# EAGLE design pneu-sensor (EAGLE 9.1.2)
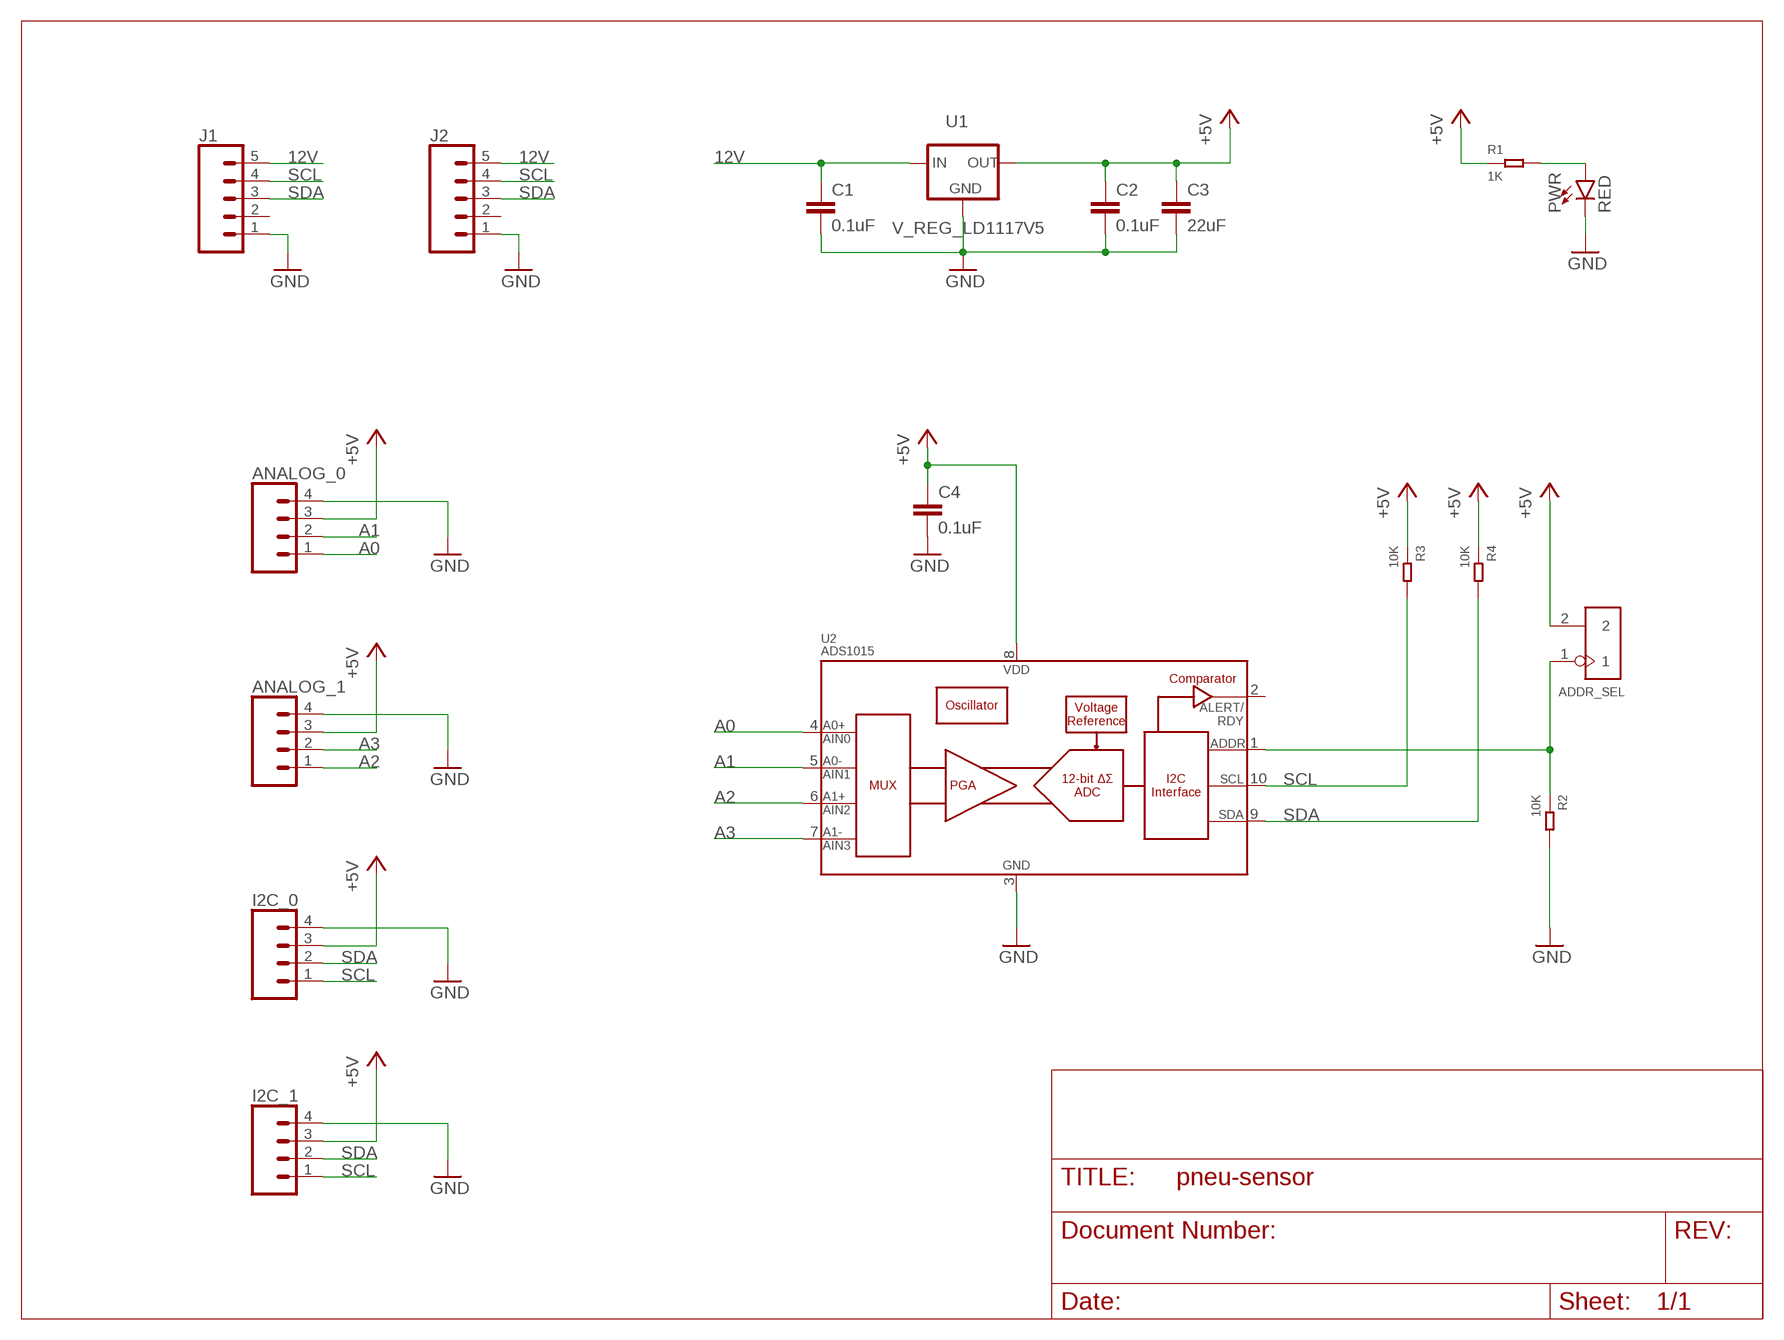
[diagram p0: schematic, sheet 1]

## Parts
ADDR_SEL  DIP-BLACK-JUMPER  [H2-2.54]
ANALOG_0  CONN_04JST-PTH-VERT  [JST-4-PTH-VERT]
ANALOG_1  CONN_04JST-PTH-VERT  [JST-4-PTH-VERT]
C1  0.1uF  0.1UF-0603-25V-(+80/-20%)  [0603]
C2  0.1uF  0.1UF-0603-25V-(+80/-20%)  [0603]
C3  22uF  10UF-1206-6.3V-20%  [1206]
C4  0.1uF  0.1UF-0603-25V-(+80/-20%)  [0603]
I2C_0  CONN_04JST-PTH-VERT  [JST-4-PTH-VERT]
I2C_1  CONN_04JST-PTH-VERT  [JST-4-PTH-VERT]
J1  CONN_05  [1X05]
J2  CONN_05  [1X05]
PWR  RED  LED-RED0603  [LED-0603]
R1  1K  SMD-RES-1K-5%-1/8W(0805)  [R0805]
R2  10K  SMD-RES-10K-1%-1/8W(0805)  [R0805]
R3  10K  SMD-RES-10K-1%-1/8W(0805)  [R0805]
R4  10K  SMD-RES-10K-1%-1/8W(0805)  [R0805]
U1  V_REG_LD1117V5  V_REG_LD1117VXXLD1117-SMD  [SOT223]
U2  ADS1015  [MSOP10]

## Nets
12V: C1.1 J1.5 J2.5 U1.3(IN)
+5V: ADDR_SEL.2 ANALOG_0.3 ANALOG_1.3 C2.1 C3.1 C4.1 I2C_0.3 I2C_1.3 R1.1 R3.1 R4.1 U1.2(OUT) U1.4(OUT) U2.8(VDD)
A0: ANALOG_0.1 U2.4(AIN0)
A1: ANALOG_0.2 U2.5(AIN1)
A2: ANALOG_1.1 U2.6(AIN2)
A3: ANALOG_1.2 U2.7(AIN3)
GND: ANALOG_0.4 ANALOG_1.4 C1.2 C2.2 C3.2 C4.2 I2C_0.4 I2C_1.4 J1.1 J2.1 PWR.C R2.2 U1.1(GND) U2.3(VSS)
N$2: ADDR_SEL.1 R2.1 U2.1(ADDR)
N$3: PWR.A R1.2
SCL: I2C_0.1 I2C_1.1 J1.4 J2.4 R3.2 U2.10(SCL)
SDA: I2C_0.2 I2C_1.2 J1.3 J2.3 R4.2 U2.9(SDA)
Unconnected: J1.2 J2.2 U2.2(ALERT/RDY)

## Library data of the parts
ADDR_SEL = Seeed-Connector:DIP-BLACK-JUMPER: 320190003
ANALOG_0 ANALOG_1 I2C_0 I2C_1 = SparkFun-Connectors:CONN_04: Multi connection point. Often used as Generic Header-pin footprint for 0.1 inch spaced/style header connections On any of the 0.1 inch spaced packages, you can populate with these: Break Away Headers - Straight <https://www.sparkfun.com/products/116> (PRT-00116) Break Away Male Headers - Right Angle <https://www.sparkfun.com/products/553> (PRT-00553) Female Headers <https://www.sparkfun.com/products/115> (PRT-00115) Break Away Headers - Machine Pin <https://www.sparkfun.com/products/117> (PRT-00117) Break Away Female Headers - Swiss Machine Pin <https://www.sparkfun.com/products/743> (PRT-00743) For SCREWTERMINALS and SPRING TERMINALS visit here: Screw Terimnals on SparkFun.com <https://www.sparkfun.com/search/results?term=Screw+Terminals> (5mm/3.5mm/2.54mm spacing) This device is also useful as a general connection point to wire up your design to another part of your project. Our various solder wires solder well into these plated through hole pads. Hook-Up Wire - Assortment (Stranded, 22 AWG) <https://www.sparkfun.com/products/11375> (PRT-11375) Hook-Up Wire - Assortment (Solid Core, 22 AWG) <https://www.sparkfun.com/products/11367> (PRT-11367) View the entire wire category on our website here <https://www.sparkfun.com/categories/141> Special notes: Molex polarized connector foot print use with SKU : PRT-08231 with associated crimp pins and housings. 1MM SMD Version SKU: PRT-10208; PROD_ID: CONN-13251
C1 C2 C4 = SparkFun-Capacitors:0.1UF: 0.1µF ceramic capacitors A capacitor is a passive two-terminal electrical component used to store electrical energy temporarily in an electric field.; PROD_ID: CAP-00810
C3 = SparkFun-Capacitors:10UF: 10.0µF ceramic capacitors A capacitor is a passive two-terminal electrical component used to store electrical energy temporarily in an electric field.; PROD_ID: CAP-10057; VALUE: 10uF
J1 J2 = SparkFun-Connectors:CONN_05: Multi connection point. Often used as Generic Header-pin footprint for 0.1 inch spaced/style header connections On any of the 0.1 inch spaced packages, you can populate with these: Break Away Headers - Straight <https://www.sparkfun.com/products/116> (PRT-00116) Break Away Male Headers - Right Angle <https://www.sparkfun.com/products/553> (PRT-00553) Female Headers <https://www.sparkfun.com/products/115> (PRT-00115) Break Away Headers - Machine Pin <https://www.sparkfun.com/products/117> (PRT-00117) Break Away Female Headers - Swiss Machine Pin <https://www.sparkfun.com/products/743> (PRT-00743) For SCREWTERMINALS and SPRING TERMINALS visit here: Screw Terimnals on SparkFun.com <https://www.sparkfun.com/search/results?term=Screw+Terminals> (5mm/3.5mm/2.54mm spacing) This device is also useful as a general connection point to wire up your design to another part of your project. Our various solder wires solder well into these plated through hole pads. Hook-Up Wire - Assortment (Stranded, 22 AWG) <https://www.sparkfun.com/products/11375> (PRT-11375) Hook-Up Wire - Assortment (Solid Core, 22 AWG) <https://www.sparkfun.com/products/11367> (PRT-11367) View the entire wire category on our website here <https://www.sparkfun.com/categories/141> Special notes: Molex polarized connector foot print use with SKU : PRT-08231 with associated crimp pins and housings. 1MM SMD Version SKU: PRT-10208
PWR = SparkFun-LED:LED-RED: Red SMD LED Used in manufacturing of most products at SparkFun Packages: 0603 - SMD 0603 package [Product Link] <http://docs.avagotech.com/docs/AV02-0551EN> 0603 SMART - SMD 0603 SMART package ( more efficient and expensive)[Product Link] <http://www.osram-os.com/Graphics/XPic2/00077099_0.pdf> 1206 - SMD1206 package [Product Link] <https://www.sparkfun.com/datasheets/DevTools/LilyPad/Q150OVS4.pdff> SparkFun Products: Pro Mini 328 -5V <https://www.sparkfun.com/products/821> RedBoard <https://www.sparkfun.com/products/12757> IOIO-OTG <https://www.sparkfun.com/products/13613>; PROD_ID: DIO-00819
R1 = Seeed-Resistor:SMD-RES-1K-5%-1/8W(0805): 301010311; MPN: RC0805JR-071KL
R2-R4 = Seeed-Resistor:SMD-RES-10K-1%-1/8W(0805): 301010361; MPN: RC0805FR-0710KL
U1 = SparkFun-IC-Power:V_REG_LD1117VXX: LD1117VXX voltage regulator. We carry the 3.3V version (COM-00526) in TO-220 package.; PROD_ID: VREG-13917
U2 = SparkFun-IC-Conversion:ADS1015: ADS1015 12-BIT ADC 12-Bit Del-Sig ADC Four single-ended inputs or two differential inputs Internal PGA I2C interface 2.0-5.5V SparkFun Products SparkFun Block for Intel Edison - ADC <https://www.sparkfun.com/products/13770> (DEV-13770); PROD_ID: IC-12270

## Board
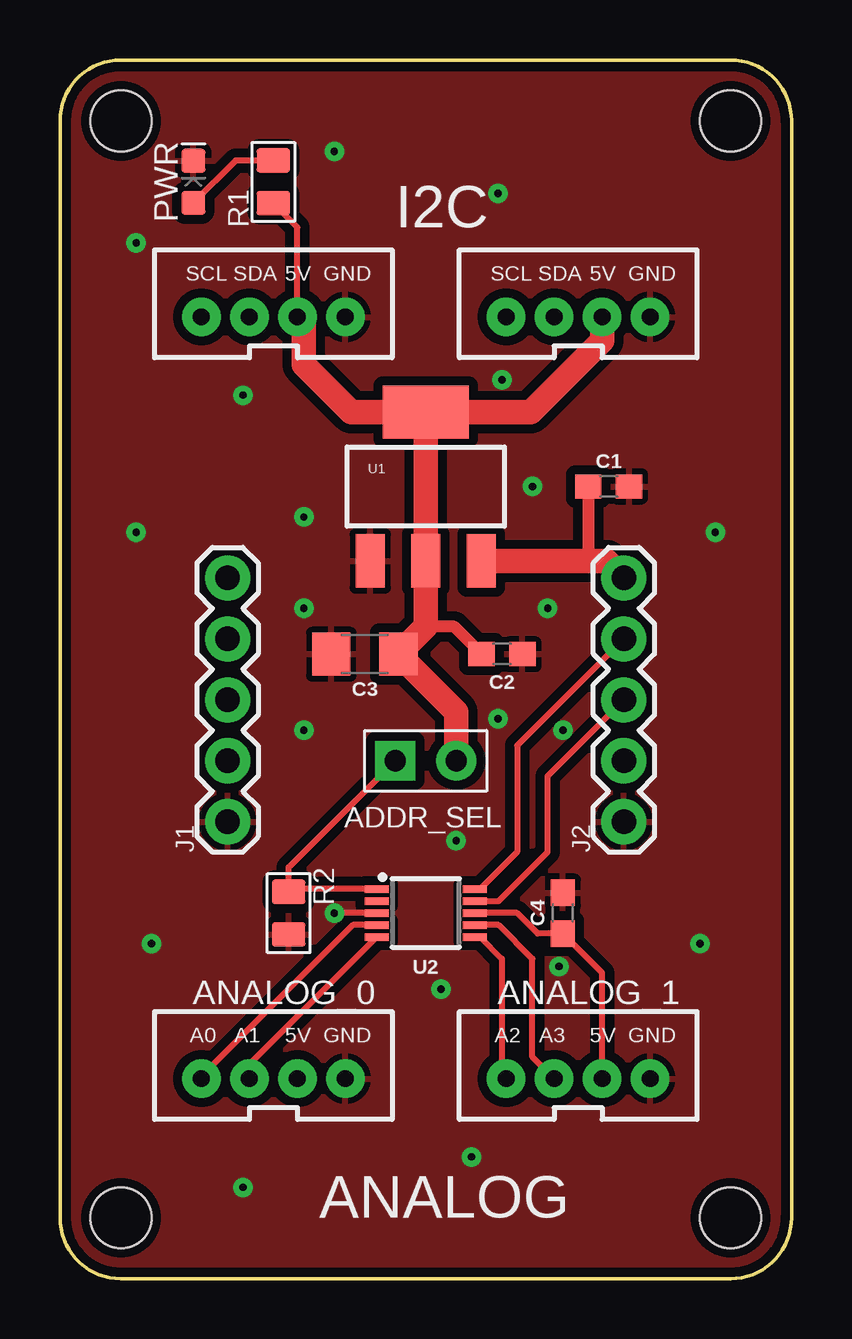
[diagram p1: board, top side]
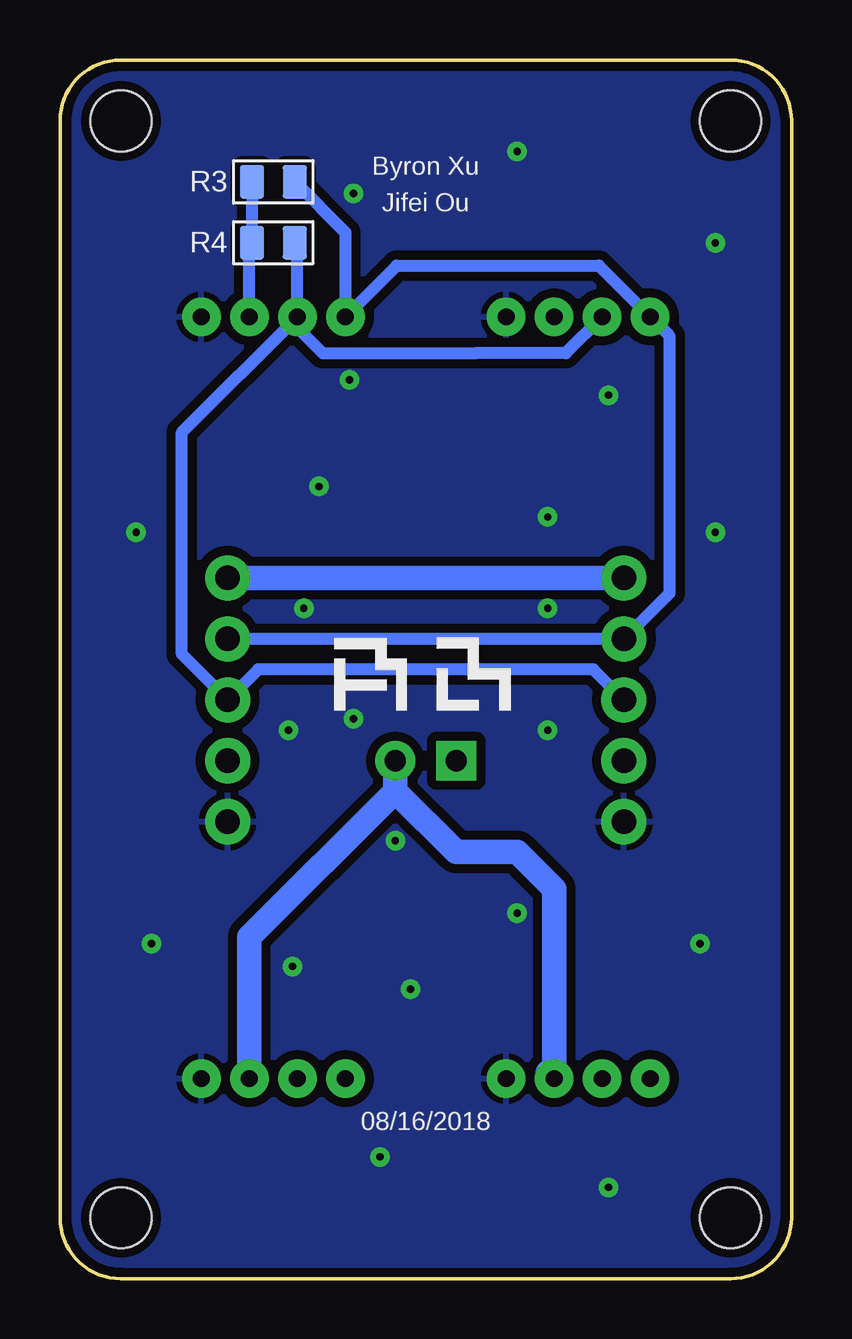
[diagram p2: board, bottom side, seen from below]

Size 30.48 x 50.8 mm. Coordinates in mm from the lower left corner, seen from the top.
Outline: 2.54,0 arc-90 0,2.54 0,48.26 arc-90 2.54,50.8 27.94,50.8 arc-90 30.48,48.26 30.48,2.54 arc-90 27.94,0 2.54,0
Copper layers (1*16): Top 0.035mm / dielectric 1.5mm / Bottom 0.035mm
Design rules "SparkFun": minimum track width 8mil, minimum drill 20mil, track to track 8mil, track to pad 8mil, pad to pad 8mil, via to via 8mil, smd to smd 8mil, copper to edge 8mil, drill to drill 8mil, minimum pad ring 12mil, minimum via ring 10mil, stop-mask expansion 4mil, vias tented up to drill 20mil, thermal gap 10mil
Holes 2.54 mm at 2.54,48.26 27.94,48.26 27.94,2.54 2.54,2.54

### Footprints (pad centres in the part's own frame; a part is rotated, then mirrored left to right if it is on the bottom)
H2-2.54 = drill 0.889 pad 1.651 square: 1 0,1.27 | drill 0.889 pad 1.651: 2 0,-1.27
JST-4-PTH-VERT = drill 0.7 pad 1.6: 1 -3,-0.55; 2 -1,-0.55; 3 1,-0.55; 4 3,-0.55
0603 = smd 1.1 x 1: 1 -0.85,0; 2 0.85,0
1206 = smd 1.6 x 1.8: 1 -1.4,0; 2 1.4,0
1X05 = drill 1.016 pad 1.88: 1 0,0; 2 2.54,0; 3 5.08,0; 4 7.62,0; 5 10.16,0
LED-0603 = smd 1 x 1: A -0.877,0; C 0.877,0
R0805 = smd 1.397 x 1.016: 1 0,0.889; 2 0,-0.889
SOT223 = smd 1.219 x 2.235: 1 -2.311,-3.099; 2 0,-3.099; 3 2.311,-3.099 | smd 3.6 x 2.2: 4 0,3.099
MSOP10 = smd 0.3 x 1: 1 -1,-2.05; 2 -0.5,-2.05; 3 0,-2.05; 4 0.5,-2.05; 5 1,-2.05; 6 1,2.05; 7 0.5,2.05; 8 0,2.05; 9 -0.5,2.05; 10 -1,2.05

### Placement (x,y rotation side)
ADDR_SEL  15.24,21.59 90 top
ANALOG_0  8.89,8.89 0 top
ANALOG_1  21.59,8.89 0 top
C1  22.86,33.02 0 top
C2  18.41,26.04 0 top
C3  12.7,26.04 180 top
C4  20.95,15.24 90 top
I2C_0  8.89,40.64 0 top
I2C_1  21.59,40.64 0 top
J1  6.99,19.05 90 top
J2  23.49,19.05 90 top
PWR  5.56,45.72 90 top
R1  8.89,45.72 180 top
R2  9.53,15.24 0 top
R3  21.59,45.72 90 bottom
R4  21.59,43.18 90 bottom
U1  15.24,33.02 0 top
U2  15.24,15.24 270 top

### Tracks (layer width: path | path; a pad name or v marks a point on that pad's centre or on a via)
12V
  Top 0.508: C1.1 22.01,30.34 21.59,29.92
  Top 1.016: J2.5 22.78,29.92 21.59,29.92 U1.3
  Bottom 1.016: J1.5 J2.5
+5V
  Top 0.254: U2.8 19.05,15.24 19.9,14.39 C4.1 22.59,12.76 ANALOG_1.3 | I2C_0.3 9.89,43.83 R1.1
  Top 0.508: C2.1 16.43,27.18 15.24,27.18
  Top 1.016: U1.4 U1.2 15.24,27.18 C3.1 16.51,23.62 ADDR_SEL.2 | I2C_1.3 22.59,39.1 19.61,36.12 U1.4 | I2C_0.3 10.16,39.82 10.16,38.1 12.14,36.12 U1.4
  Bottom 0.508: I2C_1.3 22.59,43.07 R4.1 22.48,44.83 R3.1
  Bottom 1.016: ADDR_SEL.2 16.51,20.32 | 10.16,8.61 ANALOG_0.3 9.89,16.24 11.43,17.78 13.97,17.78 16.51,20.32 | 16.51,20.32 22.59,14.24 ANALOG_1.3
A0
  Top 0.254: U2.4 12.2,14.74 5.89,8.43 ANALOG_0.1
A1
  Top 0.254: U2.5 7.89,8.94 ANALOG_0.2
A2
  Top 0.254: U2.6 17.51,14.24 18.41,13.34 18.41,8.52 ANALOG_1.1
A3
  Top 0.254: U2.7 18.28,14.74 19.68,13.34 19.68,9.24 ANALOG_1.2
GND  (via drill 0.3)
  Top 0.254: U2.3 v11.43,15.24
  other vias: 10.16,31.75 19.68,33.02 7.62,36.83 27.3,31.11 3.17,31.11 3.17,43.18 11.43,46.99 3.81,13.97 26.67,13.97 10.16,22.86 7.62,3.81 17.14,5.08 20.8,13.02 15.88,12.06 20.32,27.94 10.16,27.94 20.95,22.86 16.51,18.26 18.26,23.34 18.41,37.47 18.26,45.24
  pour Top (isolate 0.381): 0,50.8 0,0 30.48,0 30.48,50.8
  pour Bottom (isolate 0.381): 0,50.8 0,0 30.48,0 30.48,50.8
N$2
  Top 0.254: U2.1 9.64,16.24 R2.1 9.53,17.14 ADDR_SEL.1
N$3
  Top 0.254: R1.2 7.32,46.61 PWR.A
SCL
  Top 0.254: U2.10 17.51,16.24 19.05,17.78 19.05,22.23 J2.4
  Bottom 0.508: J2.4 J1.4 5.08,28.57 5.08,39.28 I2C_0.1 8.03,42.23 16.45,42.23 16.83,41.85 I2C_1.1 18.59,43.61 R3.2
SDA
  Top 0.254: U2.9 18.28,15.74 20.32,17.78 20.32,20.95 J2.3
  Bottom 0.508: I2C_1.2 25.4,35.28 25.4,26.04 J2.3 22.22,25.4 8.25,25.4 J1.3 | I2C_0.2 9.4,38.58 13.18,38.58 17.3,38.58 19.53,38.58 20.59,39.64 I2C_1.2 | I2C_1.2 20.59,43.07 R4.2

### Text on the board
tPlace: I2C | SCL SDA | 5V GND | SCL SDA | 5V GND | A0 A1 | 5V GND | A2 A3 | 5V GND | ANALOG
bNames: Byron Xu | Jifei Ou | 08/16/2018